# EAGLE design control (EAGLE 6.4)
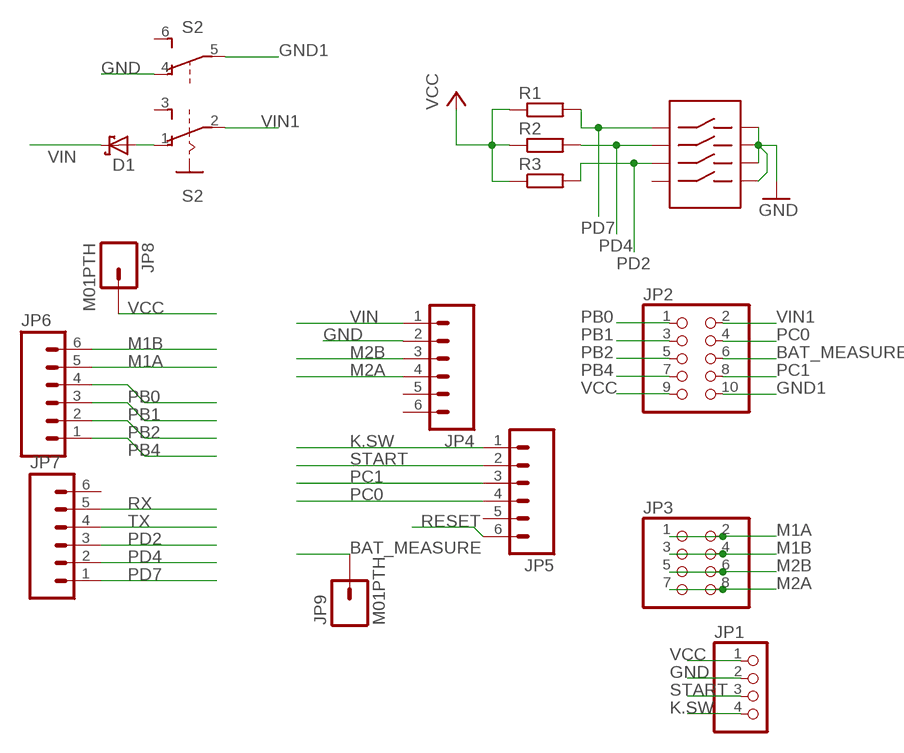
[diagram p0: schematic, sheet 1]

## Parts
D1  SCHOTTKY-DIODESMC  [SMC]
JP1  PINHD-1X4  [1X04]
JP2  PINHD-2X5  [2X05]
JP3  PINHD-2X4  [2X04]
JP4  M06SMD-STRAIGHT  [1X06_SMD_STRAIGHT]
JP5  M06SMD-STRAIGHT  [1X06_SMD_STRAIGHT]
JP6  M06SMD-STRAIGHT  [1X06_SMD_STRAIGHT]
JP7  M06SMD-STRAIGHT  [1X06_SMD_STRAIGHT]
JP8  M01PTH  [1X01]
JP9  M01PTH  [1X01]
R1  R-EU_R0805  [R0805]
R2  R-EU_R0805  [R0805]
R3  R-EU_R0805  [R0805]
S2  A68-A31  [A68-A31]
U$2  DGH04  [GDH04]

## Nets
BAT_MEASURE: JP2.6 JP9.1
GND: JP1.2 JP4.2 S2.4(B:O) U$2.P$1 U$2.P$6 U$2.P$7 U$2.P$8
GND1: JP2.10 S2.5(B:P)
K.SW: JP1.4 JP5.1
M1A: JP3.1 JP3.2 JP6.5
M1B: JP3.3 JP3.4 JP6.6
M2A: JP3.7 JP3.8 JP4.4
M2B: JP3.5 JP3.6 JP4.3
N$1: D1.A S2.1(A:O)
PB0: JP2.1 JP6.4
PB1: JP2.3 JP6.3
PB2: JP2.5 JP6.2
PB4: JP2.7 JP6.1
PC0: JP2.4 JP5.4
PC1: JP2.8 JP5.3
PD2: JP7.3 R3.2 U$2.P$4
PD4: JP7.2 R2.2 U$2.P$3
PD7: JP7.1 R1.2 U$2.P$2
RESET: JP5.6
RX: JP7.5
START: JP1.3 JP5.2
TX: JP7.4
VCC: JP1.1 JP2.9 JP8.1 R1.1 R2.1 R3.1
VIN: D1.C JP4.1
VIN1: JP2.2 S2.2(A:P)
Unconnected: JP4.5 JP4.6 JP5.5 JP7.6 S2.3(A:S) S2.6(B:S) U$2.P$5

## Library data of the parts
D1 = diode:SCHOTTKY-DIODE: Schottky Diode
JP1 = pinhead:PINHD-1X4: PIN HEADER
JP2 = pinhead:PINHD-2X5: PIN HEADER
JP3 = pinhead:PINHD-2X4: PIN HEADER
JP4-JP7 = SparkFun-Connectors:M06: Header 6 Standard 6-pin 0.1" header. Use with straight break away headers (SKU : PRT-00116), right angle break away headers (PRT-00553), swiss pins (PRT-00743), machine pins (PRT-00117), and female headers (PRT-00115). Molex polarized connector foot print use with SKU : PRT-08094 with associated crimp pins and housings. NOTES ON THE VARIANTS LOCK and LOCK_LONGPADS... This footprint was designed to help hold the alignment of a through-hole component (i.e. 6-pin header) while soldering it into place. You may notice that each hole has been shifted either up or down by 0.005 of an inch from it's more standard position (which is a perfectly straight line). This slight alteration caused the pins (the squares in the middle) to touch the edges of the holes. Because they are alternating, it causes a "brace" to hold the component in place. 0.005 has proven to be the perfect amount of "off-center" position when using our standard breakaway headers. Although looks a little odd when you look at the bare footprint, once you have a header in there, the alteration is very hard to notice. Also, if you push a header all the way into place, it is covered up entirely on the bottom side. This idea of altering the position of holes to aid alignment will be further integrated into the Sparkfun Library for other footprints. It can help hold any component with 3 or more connection pins.
JP8 JP9 = SparkFun-Connectors:M01: Header 1 Standard 1-pin 0.1" header. Use with straight break away headers (SKU : PRT-00116), right angle break away headers (PRT-00553), swiss pins (PRT-00743), machine pins (PRT-00117), and female headers (PRT-00115).
R1-R3 = rcl:R-EU_: RESISTOR, European symbol
S2 = switch:A68-A31: SLIDING SWITCH Siemens, distributor Buerklin, 11G766
U$2 = GDH Switch:DGH04

## Board
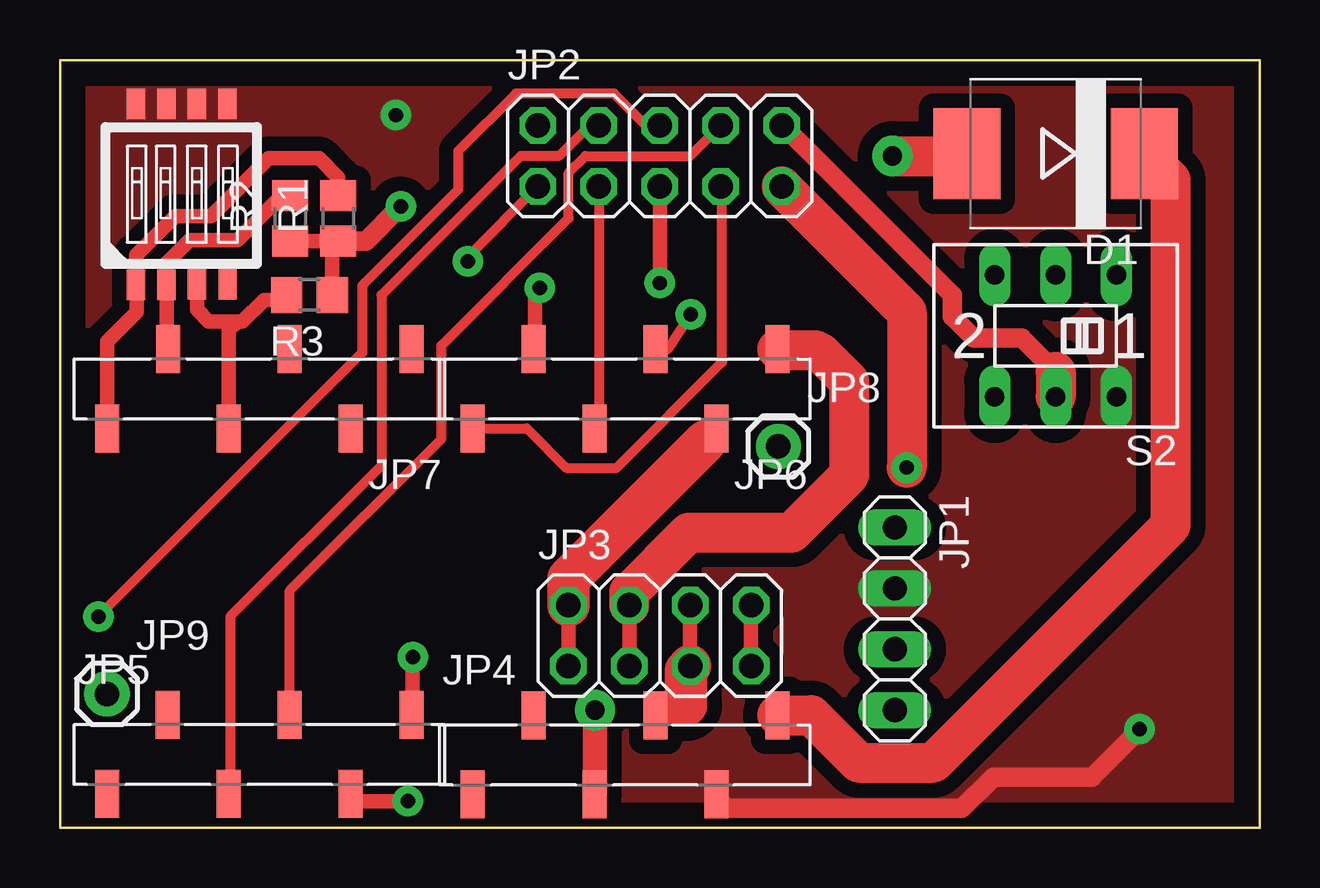
[diagram p1: board, top side]
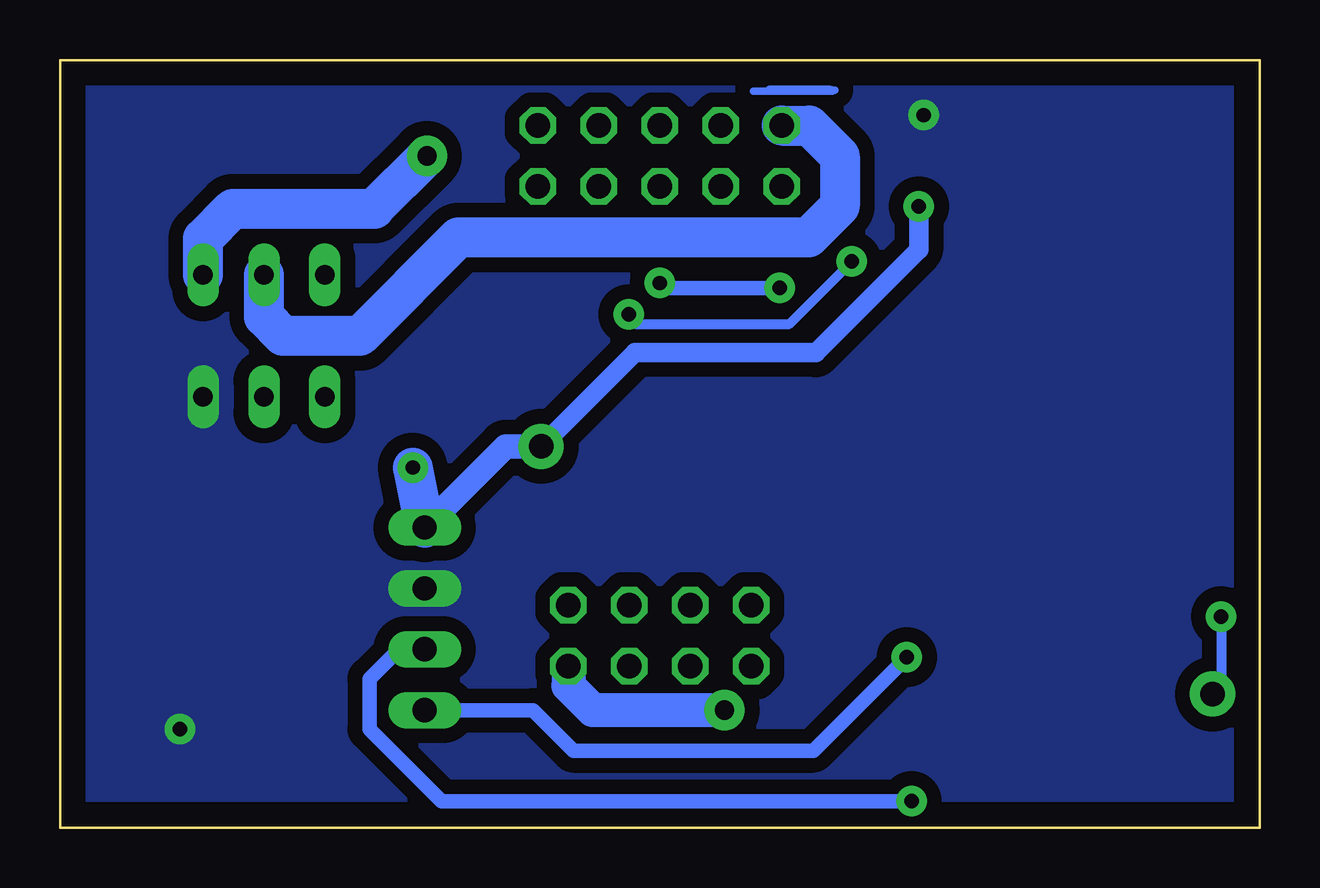
[diagram p2: board, bottom side, seen from below]

Size 50 x 32 mm. Coordinates in mm from the lower left corner, seen from the top.
Outline: 0,0 50,0 50,32 0,32 0,0
Copper layers (1*16): Top 0.035mm / dielectric 1.5mm / Bottom 0.035mm
Design rules "default": minimum track width 10mil, minimum drill 24mil, track to track 8mil, track to pad 8mil, pad to pad 8mil, via to via 8mil, smd to smd 8mil, copper to edge 40mil, drill to drill 8mil, minimum pad ring 10mil, minimum via ring 8mil, stop-mask expansion 4mil, vias tented up to drill 0mil, thermal gap 10mil

### Footprints (pad centres in the part's own frame; a part is rotated, then mirrored left to right if it is on the bottom)
SMC = smd 2.8 x 3.8: A 3.7,0; C -3.7,0
1X04 = drill 1.016 long: 1 -3.81,0; 2 -1.27,0; 3 1.27,0; 4 3.81,0
2X05 = drill 1.016 octagon: 1 -5.08,-1.27; 2 -5.08,1.27; 3 -2.54,-1.27; 4 -2.54,1.27; 5 0,-1.27; 6 0,1.27; 7 2.54,-1.27; 8 2.54,1.27; 9 5.08,-1.27; 10 5.08,1.27
2X04 = drill 1.016 octagon: 1 -3.81,-1.27; 2 -3.81,1.27; 3 -1.27,-1.27; 4 -1.27,1.27; 5 1.27,-1.27; 6 1.27,1.27; 7 3.81,-1.27; 8 3.81,1.27
1X06_SMD_STRAIGHT = smd 1 x 2: 1 0,1.65; 2 -2.54,-1.65; 3 -5.08,1.65; 4 -7.62,-1.65; 5 -10.16,1.65; 6 -12.7,-1.65
1X01 = drill 1.016 pad 1.88: 1 0,0
R0805 = smd 1.3 x 1.5: 1 -0.95,0; 2 0.95,0
A68-A31 = drill 0.813 long: 1 -2.54,-2.54; 2 0,-2.54; 3 2.54,-2.54; 4 -2.54,2.54; 5 0,2.54; 6 2.54,2.54
GDH04 = smd 0.76 x 1.27: P$1 1.88,8.26; P$2 -1.93,0.73; P$3 -0.66,0.73; P$4 0.61,0.74; P$5 1.89,0.74; P$6 0.61,8.26; P$7 -0.66,8.26; P$8 -1.93,8.26

### Placement (x,y rotation side)
D1  41.5,28.1 180 top
JP1  34.8,8.7 270 top
JP2  25,28 0 top
JP3  25,8 0 top
JP4  29.9,3.03 0 top
JP5  14.66,3.05 0 top
JP6  17.2,18.29 180 top
JP7  1.96,18.29 180 top
JP8  29.94,15.89 0 top
JP9  1.96,5.57 0 top
R1  11.6,25.4 90 top
R2  9.6,25.4 90 top
R3  10.4,22.2 180 top
S2  41.5,20.5 180 top
U$2  5.1,21.9 0 top

### Tracks (layer width: path | path; a pad name or v marks a point on that pad's centre or on a via)
BAT_MEASURE  (via drill 0.6 pad 1.27)
  Top 0.406: JP2.6 24.43,29.27 23.1,30.6 19,30.6 16.6,28.2 16.6,26.6 12.6,22.6 12.6,19.8 v1.6,8.8
  Bottom 0.406: v1.6,8.8 1.6,6.03 JP9.1
GND  (via drill 0.6 pad 1.27)
  Top 0.813: JP4.2 27.36,1.24 27.8,0.8 37.6,0.8 38.9,2.1 43,2.1 v45,4.1
  other vias: 14,29.7
  pour Top (isolate 0.61, rank 6, no thermals): -6.1,35.1 53.6,35.1 53.6,-3.3 -7.6,-3.3 -7.6,32.2
  pour Bottom (isolate 0.61, rank 6, no thermals): -0.9,33.3 51.6,33.3 51.6,-2 -3.2,-2 -3.2,31.3
GND1
  Top 0.813: JP2.10 30.13,29.27 37.2,22.2 37.2,21.3 38.1,20.4 40.1,20.4 41.5,19
  Top 1.676: 41.5,19 S2.5
K.SW  (via drill 0.6 pad 1.27)
  Top 0.61: v14.7,7.1 14.7,4.74 JP5.1
  Bottom 0.61: JP1.4 30.29,4.89 28.6,3.2 18.6,3.2 v14.7,7.1
M1A
  Top 0.61: JP3.1 JP3.2
  Top 0.813: 26.9,16.1 26.9,16.18 JP6.5
  Top 1.778: JP3.2 21.19,10.39 26.9,16.1
M1B
  Top 0.61: JP3.3 JP3.4
  Top 1.676: JP3.4 23.73,9.83 26.2,12.3 30.5,12.3 32.9,14.7 32.9,18.6 31.7,19.8 31.5,19.9 29.94,19.9 JP6.6
M2A  (via drill 0.8 pad 1.68)
  Top 0.61: JP3.8 JP3.7
  Top 1.016: v22.3,4.9 22.3,1.4 JP4.4
  Bottom 1.422: JP3.7 28.81,5.91 27.8,4.9 v22.3,4.9
M2B
  Top 0.61: JP3.6 JP3.5
  Top 0.813: JP4.3 25.68,4.68 26.1,5.1
  Top 1.778: 26.1,5.1 26.1,6.56 JP3.5
N$1  (via drill 0.8 pad 1.68)
  Top 1.676: v34.7,28 37.7,28 D1.A
  Bottom 1.676: S2.1 44.04,24.56 42.8,25.8 36.9,25.8 v34.7,28
N$2
  Bottom 0.305: 20.42,30.78 17.92,30.78 | 17.7,30.73 17.92,30.78 | 17.92,30.78 17.8,30.7 21.1,30.7
PB0  (via drill 0.6 pad 1.27)
  Top 0.406: JP6.4 25.34,19.94 v26.3,21.4 | v17,23.6 17,23.81 JP2.1
  Bottom 0.406: v26.3,21.4 26.3,21.3 26,21 19.6,21 v17,23.6
PB1
  Top 0.406: JP2.3 22.46,16.82 JP6.3
PB2  (via drill 0.6 pad 1.27)
  Top 0.61: JP2.5 v25,22.7 | v20,22.5 19.8,22.3 19.8,20 JP6.2
  Bottom 0.61: v25,22.7 24.8,22.5 v20,22.5
PB4
  Top 0.406: JP6.1 19.46,16.64 21.1,15 23.2,15 27.6,19.4 27.6,26.19 JP2.7
PC0
  Top 0.406: JP2.4 22.07,29.27 20.8,28 19.2,28 13.4,22.2 13.4,15.1 7.1,8.8 7.1,1.46 JP5.4
PC1
  Top 0.406: JP5.3 9.58,9.88 15.9,16.2 15.9,20.1 21.2,25.4 21.2,27.3 21.9,28 26.27,28 JP2.8
PD2
  Top 0.61: U$2.P$4 5.71,21.59 6.2,21.1 7.4,21.1 | 7.4,21.1 7.6,21.1 8.5,22 9.25,22 R3.2 | JP7.3 7.04,20.74 7.4,21.1
PD4
  Top 0.61: JP7.2 4.6,19.84 4.6,19.3 4.44,19.46 U$2.P$3 4.44,23.54 5.4,24.5 7.4,24.5 9.1,26.2 9.45,26.2 R2.2
PD7
  Top 0.61: JP7.1 1.96,20.26 3.2,21.5 3.2,22.6 U$2.P$2 3.17,23.87 4.8,25.5 6.3,25.5 8.7,27.9 10.8,27.9 11.6,27.1 R1.2
START  (via drill 0.6 pad 1.27)
  Top 0.61: v14.5,1.1 12.5,1.1 12.1,0.8 12.1,1.38 JP5.2
  Bottom 0.61: JP1.3 35.87,7.43 37.1,6.2 37.1,4.1 34.1,1.1 v14.5,1.1
VCC  (via drill 0.6 pad 1.27)
  Top 0.61: R2.1 R1.1 11.35,24.2 R3.1
  Top 0.813: R1.1 12.75,24.45 v14.2,25.9
  Top 1.676: JP2.9 35.3,21.5 v35.3,15.01
  Bottom 0.813: v14.2,25.9 14.2,24.1 18.5,19.8 26.03,19.8 JP8.1
  Bottom 1.016: JP8.1 31.42,15.89 JP1.1
  Bottom 1.676: v35.3,15.01 JP1.1
VIN
  Top 1.676: JP4.1 31.32,4.68 33.3,2.7 36.4,2.7 46.3,12.6 46.3,27 D1.C
VIN1
  Bottom 1.676: JP2.2 18.77,29.27 17.5,28 17.5,25.9 18.8,24.6 33.4,24.6 37.5,20.5 40.7,20.5 41.5,21.3 S2.2